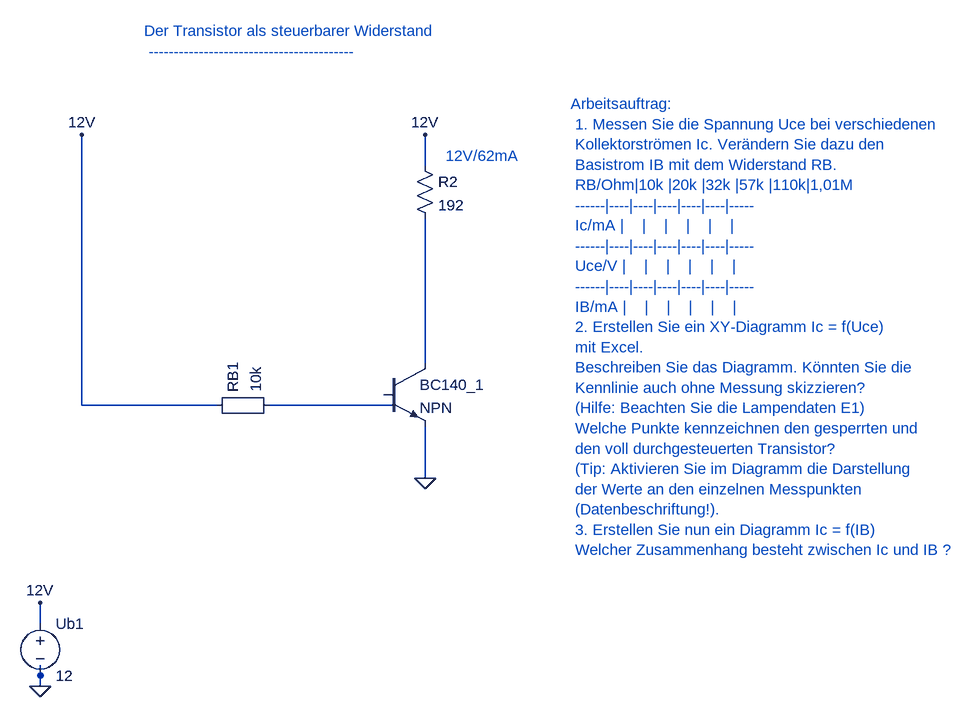
[diagram p0: schematic 3_0_1_Transistor_als_einstellbarer_Widerstand.asc]
3_0_1_Transistor_als_einstellbarer_Widerstand.asc, the LTspice schematic file:
Version 4
SHEET 1 880 680
WIRE 672 336 672 352
WIRE 80 1040 80 1024
WIRE 608 608 624 608
WIRE 624 608 624 624
WIRE 672 656 672 688
WIRE 80 1056 80 1024
WIRE 672 208 672 256
WIRE 80 960 80 928
WIRE 624 624 432 624
WIRE 672 688 672 736
WIRE 672 560 672 352
WIRE 144 208 144 624
WIRE 144 624 352 624
FLAG 672 736 0
FLAG 80 1056 0
FLAG 672 736 0
FLAG 80 1056 0
FLAG 80 928 12V
FLAG 672 208 12V
FLAG 144 208 12V
SYMBOL res 656 240 R0
SYMATTR InstName R2
SYMATTR Value 192
SYMBOL voltage 80 944 R0
SYMATTR InstName Ub1
SYMATTR Value 12
SYMBOL npn 608 560 R0
SYMATTR InstName BC140_1
SYMATTR Value NPN
SYMBOL Misc\EuropeanResistor 336 640 R270
SYMATTR InstName RB1
SYMATTR Value 10k
TEXT 240 48 Left 2 ;Der Transistor als steuerbarer Widerstand \n -----------------------------------------
TEXT 896 160 Left 2 ;Arbeitsauftrag: \n 1. Messen Sie die Spannung Uce bei verschiedenen \n Kollektorströmen Ic. Verändern Sie dazu den \n Basistrom IB mit dem Widerstand RB. \n RB/Ohm|10k |20k |32k |57k |110k|1,01M \n ------|----|----|----|----|----|----- \n Ic/mA |    |    |    |    |    | \n ------|----|----|----|----|----|----- \n Uce/V |    |    |    |    |    | \n ------|----|----|----|----|----|----- \n IB/mA |    |    |    |    |    | \n 2. Erstellen Sie ein XY-Diagramm Ic = f(Uce) \n mit Excel. \n Beschreiben Sie das Diagramm. Könnten Sie die \n Kennlinie auch ohne Messung skizzieren? \n (Hilfe: Beachten Sie die Lampendaten E1) \n Welche Punkte kennzeichnen den gesperrten und \n den voll durchgesteuerten Transistor? \n (Tip: Aktivieren Sie im Diagramm die Darstellung \n der Werte an den einzelnen Messpunkten \n (Datenbeschriftung!). \n 3. Erstellen Sie nun ein Diagramm Ic = f(IB) \n Welcher Zusammenhang besteht zwischen Ic und IB ?
TEXT 704 240 Left 2 ;12V/62mA

The netlist it stands for:
* 3_0_1_Transistor_als_einstellbarer_Widerstand.asc
R2 12V N001 192
V§Ub1 12V 0 12
Q§BC140_1 N001 N002 0 0 NPN
RB1 12V N002 10k
.model NPN NPN
.model PNP PNP
.lib standard.bjt
* Der Transistor als steuerbarer Widerstand
*  -----------------------------------------
* Arbeitsauftrag:
*  1. Messen Sie die Spannung Uce bei verschiedenen
*  Kollektorströmen Ic. Verändern Sie dazu den
*  Basistrom IB mit dem Widerstand RB.
*  RB/Ohm|10k |20k |32k |57k |110k|1,01M
*  ------|----|----|----|----|----|-----
*  Ic/mA |    |    |    |    |    |
*  ------|----|----|----|----|----|-----
*  Uce/V |    |    |    |    |    |
*  ------|----|----|----|----|----|-----
*  IB/mA |    |    |    |    |    |
*  2. Erstellen Sie ein XY-Diagramm Ic = f(Uce)
*  mit Excel.
*  Beschreiben Sie das Diagramm. Könnten Sie die
*  Kennlinie auch ohne Messung skizzieren?
*  (Hilfe: Beachten Sie die Lampendaten E1)
*  Welche Punkte kennzeichnen den gesperrten und
*  den voll durchgesteuerten Transistor?
*  (Tip: Aktivieren Sie im Diagramm die Darstellung
*  der Werte an den einzelnen Messpunkten
*  (Datenbeschriftung!).
*  3. Erstellen Sie nun ein Diagramm Ic = f(IB)
*  Welcher Zusammenhang besteht zwischen Ic und IB ?
* 12V/62mA
.backanno
.end